# EAGLE design MIDILOOP.Schematic (EAGLE 7.5.0)
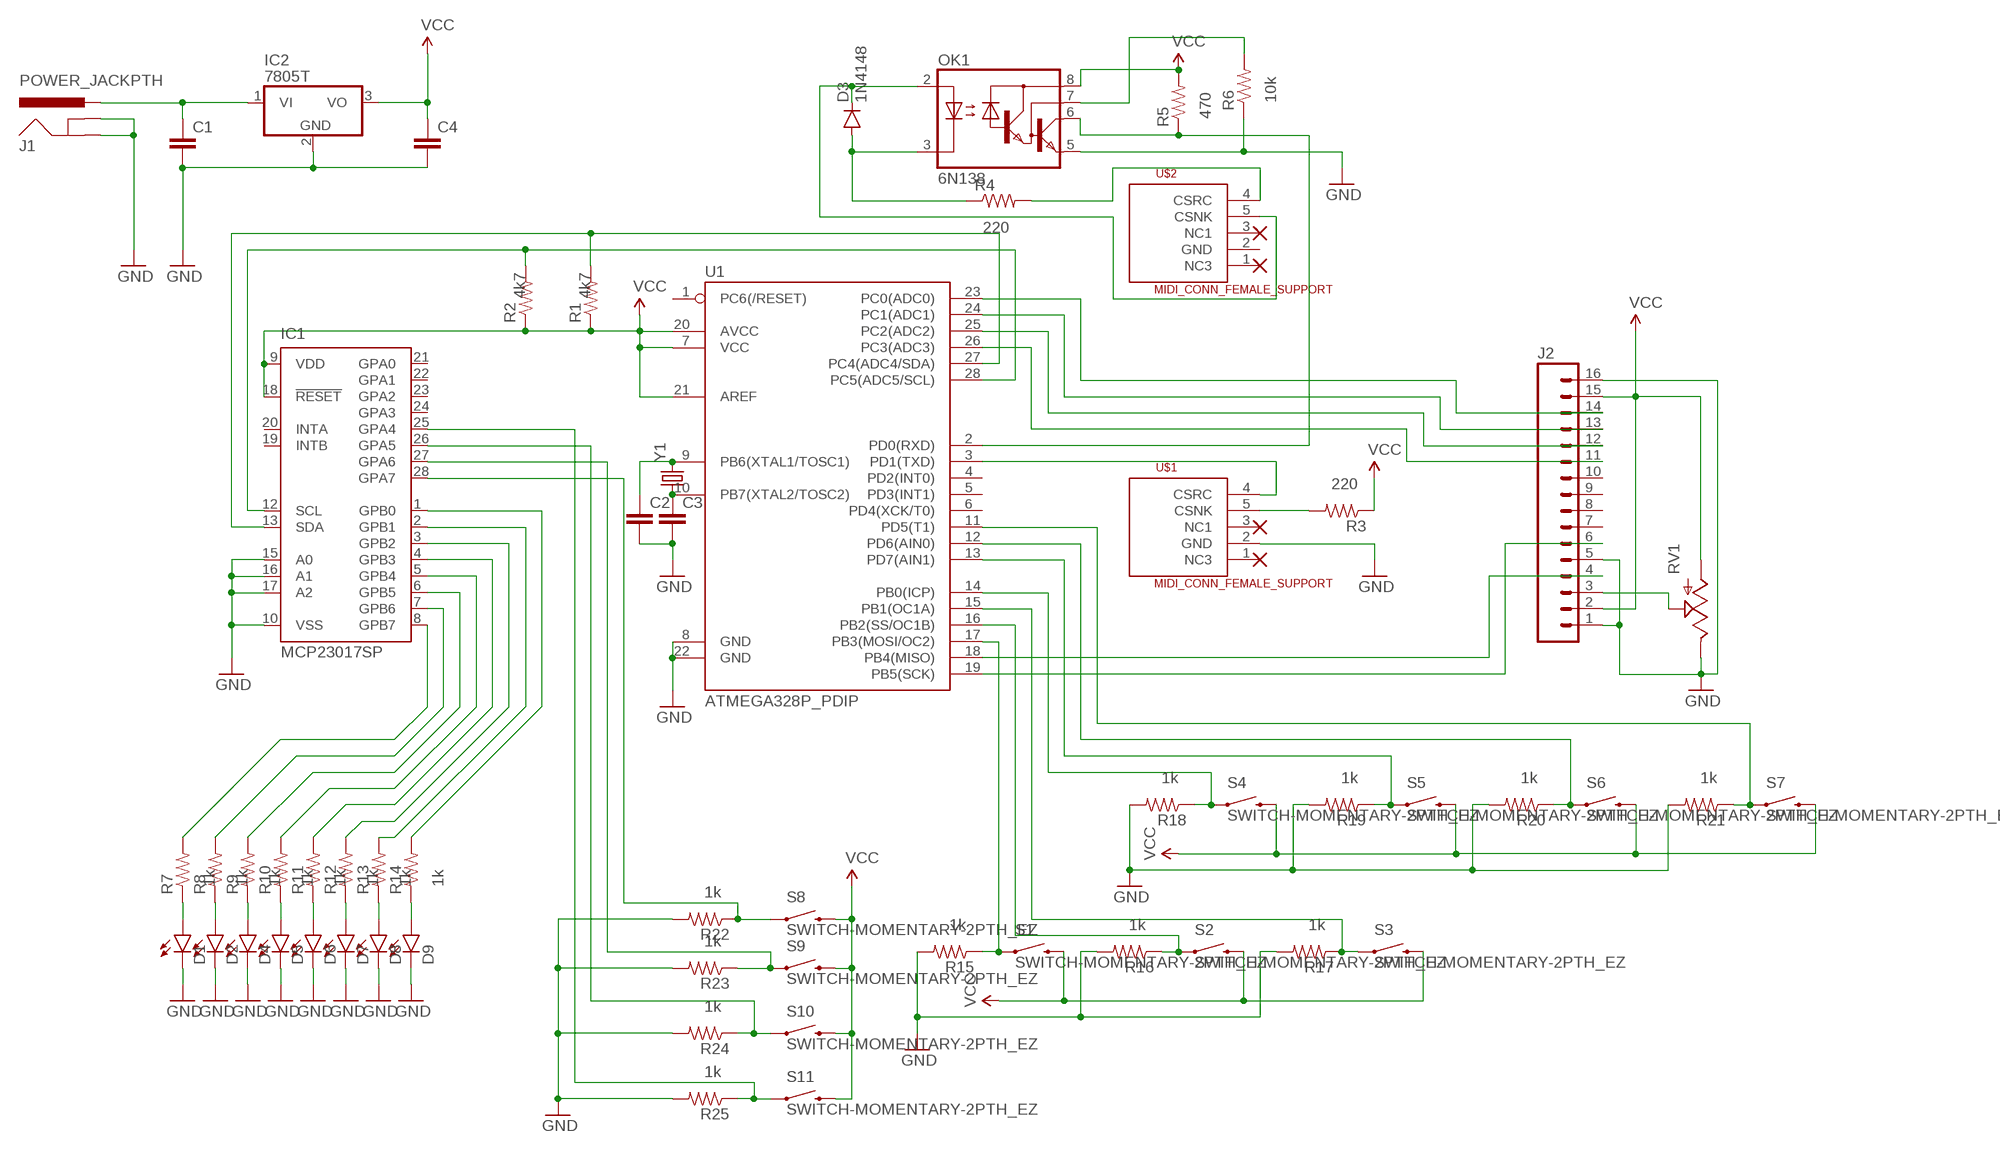
[diagram p0: schematic, sheet 1]

## Parts
C1  CAPPTH1  [CAP-PTH-5MM]
C2  CAPPTH  [CAP-PTH-SMALL]
C3  CAPPTH  [CAP-PTH-SMALL]
C4  CAPPTH1  [CAP-PTH-5MM]
D1  LED3MM  [LED3MM]
D2  LED3MM  [LED3MM]
D3  1N4148  DIODE1N4148  [DIODE-1N4148]
D4  LED3MM  [LED3MM]
D5  LED3MM  [LED3MM]
D6  LED3MM  [LED3MM]
D7  LED3MM  [LED3MM]
D8  LED3MM  [LED3MM]
D9  LED3MM  [LED3MM]
IC1  MCP23017SP  [DIL28-3]
IC2  7805T  [TO220H]
J1  POWER_JACKPTH  [POWER_JACK_PTH]
J2  M16LONGPADS  [1X16_LONGPADS]
OK1  6N138  [DIL08]
R1  RESISTOREZ  [AXIAL-0.3EZ]
R2  RESISTOREZ  [AXIAL-0.3EZ]
R3  RESISTOREZ  [AXIAL-0.3EZ]
R4  RESISTOREZ  [AXIAL-0.3EZ]
R5  RESISTOREZ  [AXIAL-0.3EZ]
R6  RESISTOREZ  [AXIAL-0.3EZ]
R7  RESISTOREZ  [AXIAL-0.3EZ]
R8  RESISTOREZ  [AXIAL-0.3EZ]
R9  RESISTOREZ  [AXIAL-0.3EZ]
R10  RESISTOREZ  [AXIAL-0.3EZ]
R11  RESISTOREZ  [AXIAL-0.3EZ]
R12  RESISTOREZ  [AXIAL-0.3EZ]
R13  RESISTOREZ  [AXIAL-0.3EZ]
R14  RESISTOREZ  [AXIAL-0.3EZ]
R15  RESISTOREZ  [AXIAL-0.3EZ]
R16  RESISTOREZ  [AXIAL-0.3EZ]
R17  RESISTOREZ  [AXIAL-0.3EZ]
R18  RESISTOREZ  [AXIAL-0.3EZ]
R19  RESISTOREZ  [AXIAL-0.3EZ]
R20  RESISTOREZ  [AXIAL-0.3EZ]
R21  RESISTOREZ  [AXIAL-0.3EZ]
R22  RESISTOREZ  [AXIAL-0.3EZ]
R23  RESISTOREZ  [AXIAL-0.3EZ]
R24  RESISTOREZ  [AXIAL-0.3EZ]
R25  RESISTOREZ  [AXIAL-0.3EZ]
RV1  POTTRIM  [TRIM_POT]
S1  SWITCH-MOMENTARY-2PTH_EZ  [TACTILE-PTH-EZ]
S2  SWITCH-MOMENTARY-2PTH_EZ  [TACTILE-PTH-EZ]
S3  SWITCH-MOMENTARY-2PTH_EZ  [TACTILE-PTH-EZ]
S4  SWITCH-MOMENTARY-2PTH_EZ  [TACTILE-PTH-EZ]
S5  SWITCH-MOMENTARY-2PTH_EZ  [TACTILE-PTH-EZ]
S6  SWITCH-MOMENTARY-2PTH_EZ  [TACTILE-PTH-EZ]
S7  SWITCH-MOMENTARY-2PTH_EZ  [TACTILE-PTH-EZ]
S8  SWITCH-MOMENTARY-2PTH_EZ  [TACTILE-PTH-EZ]
S9  SWITCH-MOMENTARY-2PTH_EZ  [TACTILE-PTH-EZ]
S10  SWITCH-MOMENTARY-2PTH_EZ  [TACTILE-PTH-EZ]
S11  SWITCH-MOMENTARY-2PTH_EZ  [TACTILE-PTH-EZ]
U1  ATMEGA328P_PDIP  [DIL28-3]
U$1  MIDI_CONN_FEMALE_SUPPORT  [DIN_5_FEMALE_SUPPORT]
U$2  MIDI_CONN_FEMALE_SUPPORT  [DIN_5_FEMALE_SUPPORT]
Y1  CRYSTALHC49US  [HC49US]

## Nets
GND: C1.2 C2.2 C3.2 C4.2 D1.K(C) D2.K(C) D4.K(C) D5.K(C) D6.K(C) D7.K(C) D8.K(C) D9.K(C) IC1.10(VSS) IC1.15(A0) IC1.16(A1) IC1.17(A2) IC2.2(GND) J1.GND J1.GNDBREAK J2.1 J2.5 J2.16 OK1.5(GND) R6.P$1 R15.P$2 R16.P$2 R17.P$2 R18.P$2 R19.P$2 R20.P$2 R21.P$2 R22.P$2 R23.P$2 R24.P$2 R25.P$2 RV1.2(E) U1.8(GND) U1.22(GND) U$1.2(GND)
N$1: C2.1 U1.9(PB6(XTAL1/TOSC1)) Y1.2
N$2: U1.3(PD1(TXD)) U$1.4(CSRC)
N$3: IC1.13(SDA) R1.P$2 U1.27(PC4(ADC4/SDA))
N$4: IC1.12(SCL) R2.P$2 U1.28(PC5(ADC5/SCL))
N$5: C3.1 U1.10(PB7(XTAL2/TOSC2)) Y1.1
N$6: R3.P$2 U$1.5(CSNK)
N$7: R4.P$2 U$2.4(CSRC)
N$8: D3.C OK1.2(A) U$2.5(CSNK)
N$9: D3.A OK1.3(C) R4.P$1
N$10: IC1.8(GPB7) R7.P$2
N$11: OK1.6(VO) R5.P$1 U1.2(PD0(RXD))
N$12: OK1.7(VB) R6.P$2
N$13: D1.A R7.P$1
N$14: IC1.7(GPB6) R8.P$2
N$15: D2.A R8.P$1
N$16: IC1.6(GPB5) R9.P$2
N$17: IC1.4(GPB3) R11.P$2
N$18: IC1.3(GPB2) R12.P$2
N$20: IC1.2(GPB1) R13.P$2
N$21: IC1.1(GPB0) R14.P$2
N$22: D4.A R9.P$1
N$23: D5.A R10.P$1
N$24: D6.A R11.P$1
N$25: D7.A R12.P$1
N$26: D8.A R13.P$1
N$27: D9.A R14.P$1
N$28: R15.P$1 S1.1 U1.17(PB3(MOSI/OC2))
N$29: R18.P$1 S4.1 U1.14(PB0(ICP))
N$30: R16.P$1 S2.1 U1.16(PB2(SS/OC1B))
N$31: R17.P$1 S3.1 U1.15(PB1(OC1A))
N$32: R19.P$1 S5.1 U1.13(PD7(AIN1))
N$33: J2.3 RV1.1(S)
N$34: R20.P$1 S6.1 U1.12(PD6(AIN0))
N$35: J2.4 U1.18(PB4(MISO))
N$36: J2.6 U1.19(PB5(SCK))
N$37: R21.P$1 S7.1 U1.11(PD5(T1))
N$38: J2.14 U1.23(PC0(ADC0))
N$39: J2.11 U1.26(PC3(ADC3))
N$40: J2.12 U1.25(PC2(ADC2))
N$41: J2.13 U1.24(PC1(ADC1))
N$42: IC1.27(GPA6) R23.P$1 S9.1
N$43: IC1.28(GPA7) R22.P$1 S8.1
N$44: IC1.26(GPA5) R24.P$1 S10.1
N$45: IC1.25(GPA4) R25.P$1 S11.1
N$46: C1.1 IC2.1(VI) J1.PWR
N$47: IC1.5(GPB4) R10.P$2
VCC: C4.1 IC1.9(VDD) IC1.18(!RESET) IC2.3(VO) J2.2 J2.15 OK1.8(VCC) R1.P$1 R2.P$1 R3.P$1 R5.P$2 RV1.3(A) S1.3 S2.3 S3.3 S4.3 S5.3 S6.3 S7.3 S8.3 S9.3 S10.3 S11.3 U1.7(VCC) U1.20(AVCC) U1.21(AREF)
Unconnected: IC1.19(INTB) IC1.20(INTA) IC1.21(GPA0) IC1.22(GPA1) IC1.23(GPA2) IC1.24(GPA3) J2.7 J2.8 J2.9 J2.10 U1.1(PC6(/RESET)) U1.4(PD2(INT0)) U1.5(PD3(INT1)) U1.6(PD4(XCK/T0)) U$1.1(NC3) U$1.3(NC1) U$2.1(NC3) U$2.2(GND) U$2.3(NC1)

## Library data of the parts
C1 C4 = SparkFun-Passives:CAP: Capacitor Standard 0603 ceramic capacitor, and 0.1" leaded capacitor.
C2 C3 = SparkFun-Capacitors:CAP: Capacitor Standard 0603 ceramic capacitor, and 0.1" leaded capacitor.
D1 D2 D4-D9 = SparkFun-LED:LED: LEDs Standard schematic elements and footprints for 5mm, 3mm, 1206, and 0603 sized LEDs. 5mm - Spark Fun Electronics SKU : COM-00529 (and others); PROD_ID: DIO-08794
D3 = SparkFun-DiscreteSemi:DIODE: Diode These are standard reverse protection diodes and small signal diodes. SMA package can handle up to about 1A. SOD-323 can handle about 200mA. What the SOD-323 package when ordering, there are some mfgs out there that are 5-pin packages.; PROD_ID: DIO-08378
IC1 = microchip:MCP23017: http://ww1.microchip.com/downloads/en/DeviceDoc/21952a.pdf Source: http://ww1.microchip.com/downloads/en/DeviceDoc/21952a.pdf; MF: MICROCHIP; MPN: MCP23017-E/SP; OC_FARNELL: 1332088; OC_NEWARK: 31K2959
IC2 = linear:78*: Positive VOLTAGE REGULATOR Source: http://cache.national.com/ds/LM/LM78L05.pdf http://www.fairchildsemi.com/ds/LM/LM7805.pdf
J1 = SparkFun-Connectors:POWER_JACK: Power Jack This is the standard 5.5mm barrel jack for power. The PTH is the most common, proven, reliable, footprint. The Slot footprint only works if the mill layer is transmitted to the PCB fab house so be warned. Mating wall wart : TOL-00298 (and others); PROD_ID: CONN-08197
J2 = SparkFun-Connectors:M16: 1x16 .1" header
OK1 = optocoupler:6N138: MOTOROLA OPTO COUPLER; MF: VISHAY/TELEFUNKEN; MPN: 6N138; OC_FARNELL: 9860150; OC_NEWARK: 35K5294
R1 R2 = SparkFun-Passives:RESISTOR: Resistor Basic schematic elements and footprints for 0603, 1206, and PTH resistors.; RESISTANCE: 4k7
R3 R4 = SparkFun-Passives:RESISTOR: Resistor Basic schematic elements and footprints for 0603, 1206, and PTH resistors.; RESISTANCE: 220
R5 = SparkFun-Passives:RESISTOR: Resistor Basic schematic elements and footprints for 0603, 1206, and PTH resistors.; RESISTANCE: 470
R6 = SparkFun-Passives:RESISTOR: Resistor Basic schematic elements and footprints for 0603, 1206, and PTH resistors.; RESISTANCE: 10k
R7-R25 = SparkFun-Passives:RESISTOR: Resistor Basic schematic elements and footprints for 0603, 1206, and PTH resistors.; RESISTANCE: 1k
RV1 = SparkFun-Electromechanical:POT
S1-S11 = SparkFun-Electromechanical:SWITCH-MOMENTARY-2: Various NO switches- pushbuttons, reed, etc
U1 = SparkFun-DigitalIC:ATMEGA328P_PDIP: uC used in the Arduino 32kb flash, 1k EEPROM, 2k SRAM This is the through-hole version of this chip.
U$1 U$2 = SparkFun-Connectors:MIDI_CONN_FEMALE_SUPPORT: MIDI connector with strain relief (DIN-5 female)
Y1 = SparkFun-FreqCtrl:CRYSTAL: Various standard crystals. Proven footprints.

## Board
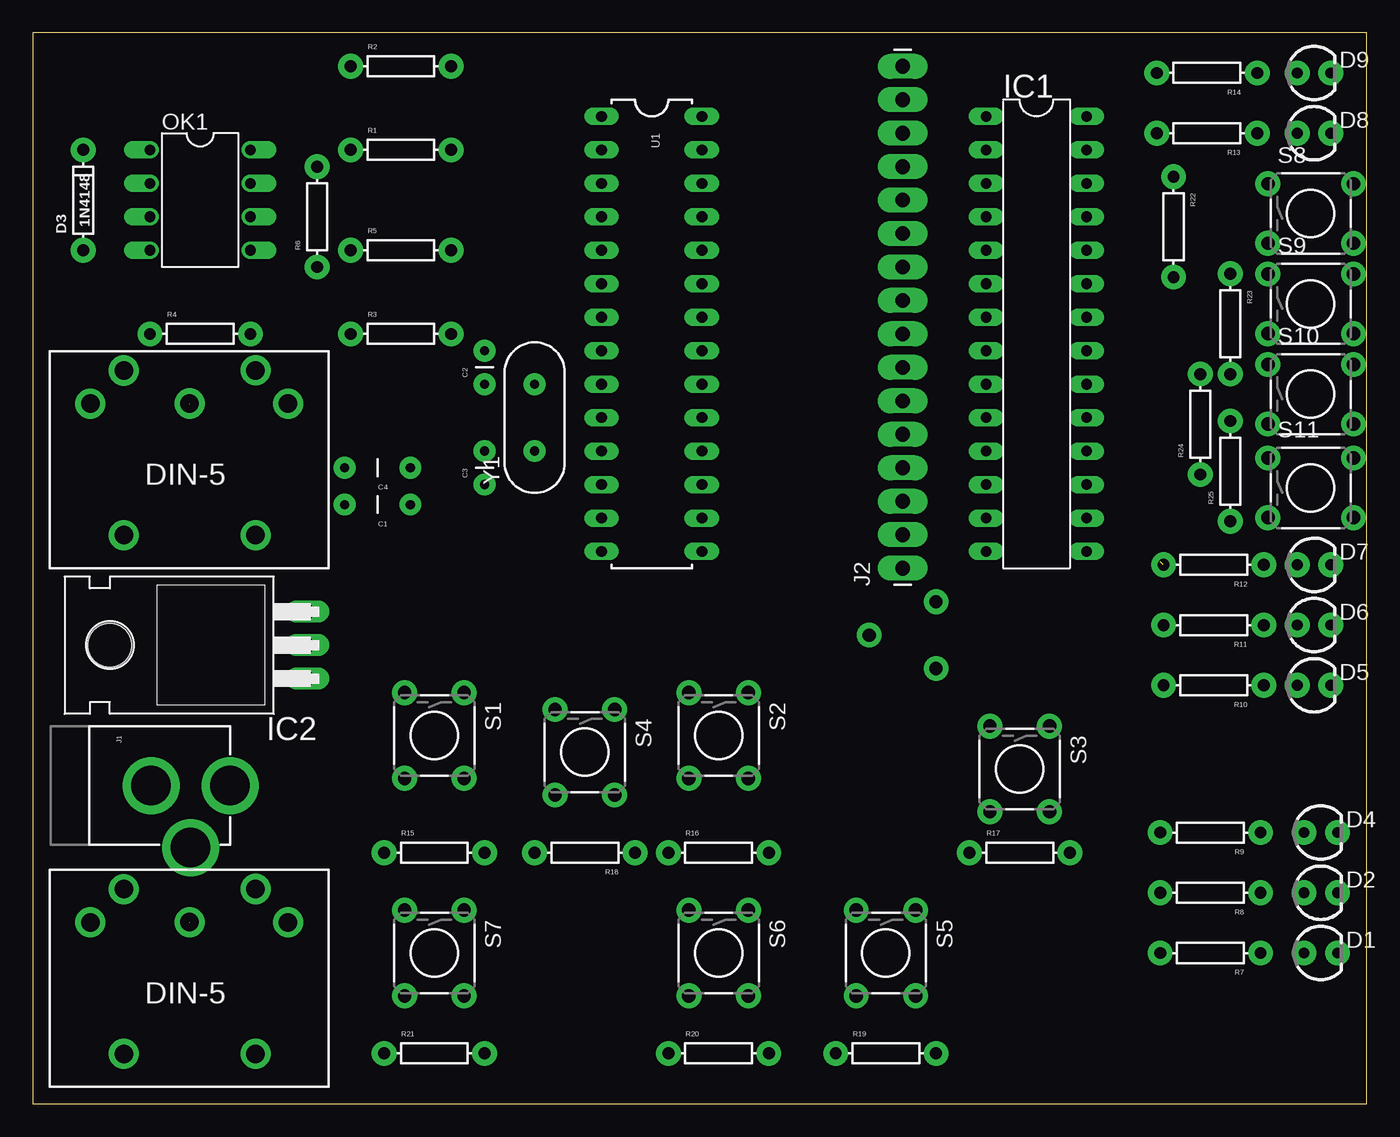
[diagram p1: board, top side]
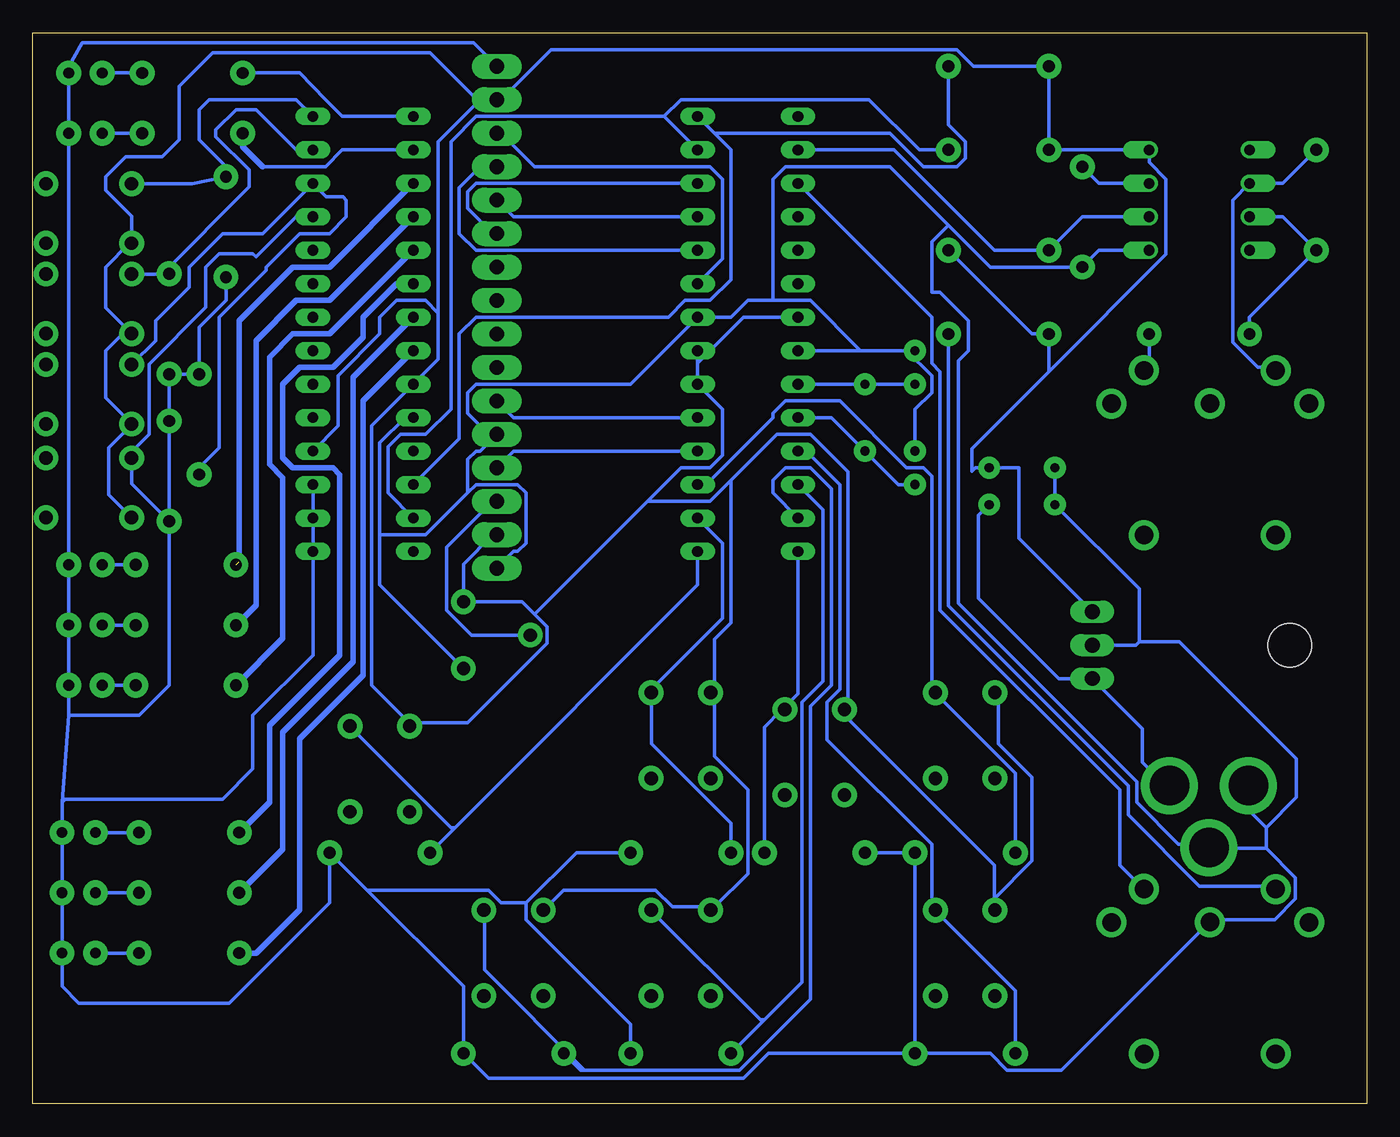
[diagram p2: board, bottom side, seen from below]

Size 101.27 x 81.27 mm. Coordinates in mm from the lower left corner, seen from the top.
Outline: 0,0 101.27,0 101.27,81.27 0,81.27 0,0
Copper layers (1*16): Top 0.035mm / dielectric 1.5mm / Bottom 0.035mm
Design rules "default": minimum track width 10mil, minimum drill 24mil, track to track 8mil, track to pad 8mil, pad to pad 8mil, via to via 8mil, smd to smd 8mil, copper to edge 40mil, drill to drill 8mil, minimum pad ring 10mil, minimum via ring 8mil, stop-mask expansion 4mil, vias tented up to drill 0mil, thermal gap 10mil

### Footprints (pad centres in the part's own frame; a part is rotated, then mirrored left to right if it is on the bottom)
CAP-PTH-5MM = drill 0.7 pad 1.651: 1 -2.5,0; 2 2.5,0
CAP-PTH-SMALL = drill 0.7 pad 1.651: 1 0,0; 2 2.54,0
LED3MM = drill 0.813 pad 1.88: A -1.27,0; K 1.27,0
DIODE-1N4148 = drill 0.9 pad 1.88: A -3.81,0; C 3.81,0
DIL28-3 = drill 0.813 long: 1 -16.51,-3.81; 2 -13.97,-3.81; 3 -11.43,-3.81; 4 -8.89,-3.81; 5 -6.35,-3.81; 6 -3.81,-3.81; 7 -1.27,-3.81; 8 1.27,-3.81; 9 3.81,-3.81; 10 6.35,-3.81; 11 8.89,-3.81; 12 11.43,-3.81; 13 13.97,-3.81; 14 16.51,-3.81; 15 16.51,3.81; 16 13.97,3.81; 17 11.43,3.81; 18 8.89,3.81; 19 6.35,3.81; 20 3.81,3.81; 21 1.27,3.81; 22 -1.27,3.81; 23 -3.81,3.81; 24 -6.35,3.81; 25 -8.89,3.81; 26 -11.43,3.81; 27 -13.97,3.81; 28 -16.51,3.81
TO220H = drill 1.118 long: 1 -2.54,-10.16; 2 0,-10.16; 3 2.54,-10.16 | hole 3.302: 0,4.826
POWER_JACK_PTH = drill 2.997 pad 4.318: GND 0,7.7; GNDBREAK 4.7,10.7; PWR 0,13.7
1X16_LONGPADS = drill 1.118 pad 1.88 long: 1 0,0; 2 2.54,0; 3 5.08,0; 4 7.62,0; 5 10.16,0; 6 12.7,0; 7 15.24,0; 8 17.78,0; 9 20.32,0; 10 22.86,0; 11 25.4,0; 12 27.94,0; 13 30.48,0; 14 33.02,0; 15 35.56,0; 16 38.1,0
DIL08 = drill 0.813 offset: 1 -3.81,-3.81; 2 -1.27,-3.81; 3 1.27,-3.81; 4 3.81,-3.81; 5 3.81,3.81; 6 1.27,3.81; 7 -1.27,3.81; 8 -3.81,3.81
AXIAL-0.3EZ = drill 0.9 pad 1.88: P$1 -3.81,0; P$2 3.81,0
TRIM_POT = drill 1 pad 1.88: 1 5.08,0; 2 0,2.54; 3 0,-2.54
TACTILE-PTH-EZ = drill 1.016 pad 1.88: 1 -3.251,2.261; 2 3.251,2.261; 3 -3.251,-2.261; 4 3.251,-2.261
DIN_5_FEMALE_SUPPORT = drill 1.4 pad 2.286: 1 7.94,3.6; 2 0.46,3.61; 3 -7.07,3.6; 4 5.47,6.13; 5 -4.53,6.12; 6 -4.53,-6.382; 7 5.478,-6.382
HC49US = drill 0.7 pad 1.651: 1 -2.54,0; 2 2.54,0

### Placement (x,y rotation side)
C1  26.16,45.47 180 top
C2  34.29,54.61 90 top
C3  34.29,46.99 90 top
C4  26.16,48.26 180 top
D1  97.79,11.43 0 top
D2  97.79,16 0 top
D3  3.81,68.58 90 top
D4  97.79,20.57 0 top
D5  97.28,31.75 0 top
D6  97.28,36.32 0 top
D7  97.28,40.89 0 top
D8  97.28,73.66 0 top
D9  97.28,78.23 0 top
IC1  76.2,58.42 270 top
IC2  10.67,34.8 90 top
J1  1.27,24.13 270 top
J2  66.04,40.64 90 top
OK1  12.7,68.58 270 top
R1  27.94,72.39 0 top
R2  27.94,78.74 0 top
R3  27.94,58.42 0 top
R4  12.7,58.42 0 top
R5  27.94,64.77 0 top
R6  21.59,67.31 90 top
R7  89.41,11.43 180 top
R8  89.41,16 180 top
R9  89.41,20.57 180 top
R10  89.66,31.75 180 top
R11  89.66,36.32 180 top
R12  89.66,40.89 180 top
R13  89.15,73.66 180 top
R14  89.15,78.23 180 top
R15  30.48,19.05 0 top
R16  52.07,19.05 0 top
R17  74.93,19.05 0 top
R18  41.91,19.05 180 top
R19  64.77,3.81 0 top
R20  52.07,3.81 0 top
R21  30.48,3.81 0 top
R22  86.61,66.55 270 top
R23  90.93,59.18 270 top
R24  88.65,51.56 90 top
R25  90.93,48.01 90 top
RV1  68.58,35.56 180 top
S1  30.48,27.94 270 top
S2  52.07,27.94 270 top
S3  74.93,25.4 270 top
S4  41.91,26.67 270 top
S5  64.77,11.43 270 top
S6  52.07,11.43 270 top
S7  30.48,11.43 270 top
S8  97.03,67.56 0 top
S9  97.03,60.71 0 top
S10  97.03,53.85 0 top
S11  97.03,46.74 0 top
U1  46.99,58.42 270 top
U$1  11.43,10.16 0 top
U$2  11.43,49.53 0 top
Y1  38.1,52.07 90 top

### Tracks (layer width: path | path; a pad name or v marks a point on that pad's centre or on a via)
GND
  Bottom 0.254: IC1.10 73.03,52.07 74.93,50.16 74.93,43.18 | 74.93,43.18 74.93,39.37 RV1.2 | J2.1 64.77,41.91 64.45,41.91 63.82,42.55 63.82,46.35 64.45,46.99 67.63,46.99 68.26,46.35 | 68.26,46.35 71.44,43.18 74.93,43.18 | 66.36,50.48 67.31,49.53 67.63,49.53 68.26,48.9 68.26,46.35 | OK1.5 20.32,64.77 R6.P$1 28.57,63.5 31.75,66.67 | 34.92,57.15 38.42,57.15 | 38.42,57.15 U1.8 | 45.09,60.96 42.23,60.96 38.42,57.15 | 45.09,60.96 46.99,60.96 48.26,59.69 U1.22 55.88,54.61 67.63,54.61 68.26,53.98 68.26,52.39 66.36,50.48 | C3.2 34.29,52.7 33.02,53.98 33.02,55.24 34.92,57.15 | 34.92,57.15 C2.2 | 31.75,66.67 36.2,71.12 44.13,71.12 45.09,70.17 45.09,60.96 | 66.36,50.48 J2.5 | R21.P$2 R15.P$2 R18.P$2 | 7.62,19.37 5.4,17.14 5.4,15.56 6.99,13.97 11.75,13.97 U$1.2 12.06,13.65 23.18,2.54 27.3,2.54 28.57,3.81 R21.P$2 | 7.62,19.37 11.75,19.37 J1.GNDBREAK 12.06,19.68 14.29,19.68 17.46,22.86 17.46,24.45 30.99,37.97 30.99,56.39 30.23,57.15 30.23,59.44 32.38,61.59 33.02,61.59 33.02,65.41 31.75,66.67 | 7.62,20.95 7.62,19.37 | R20.P$2 55.88,6.03 63.82,13.97 63.82,15.24 | 63.82,15.24 60.01,19.05 R16.P$2 | 75.88,16.19 R17.P$2 78.74,15.24 86.36,7.62 97.79,7.62 99.06,8.89 D1.K D2.K D4.K 99.06,22.86 | 75.88,16.19 68.58,8.89 R19.P$2 66.67,1.91 47.31,1.91 45.4,3.81 R21.P$2 | 63.82,15.24 65.72,15.24 66.67,16.19 75.88,16.19 | IC1.17 IC1.16 IC1.15 80.01,34.04 84.58,29.46 84.58,25.4 86.87,23.11 98.81,23.11 99.06,22.86 | 98.55,29.46 D5.K D6.K D7.K D8.K D9.K 98.81,78.23 97.54,80.52 67.82,80.52 J2.16 | 98.55,29.46 99.06,22.86 | C4.2 C1.2 17.27,39.08 17.27,35.05 | 17.27,35.05 17.53,34.8 IC2.2 | 7.62,20.95 8.97,22.3 J1.GND
  Bottom 0.254: 7.62,20.95 5.33,23.24 5.33,26.16 14.22,35.05 17.27,35.05 | 98.55,29.46 93.22,29.46 90.93,31.75 R25.P$2 R23.P$2 R24.P$2 88.65,58.93 86.61,60.96 R22.P$2
N$1
  Bottom 0.254: U1.9 Y1.2 C2.1
N$2
  Bottom 0.254: U1.3 33.02,59.69 33.02,56.2 32.38,55.56 32.38,37.47 18.73,23.81 18.73,18.1 17.14,16.51 U$1.4
N$3
  Bottom 0.254: IC1.13 74.3,46.35 74.3,49.85 73.34,50.8 71.44,50.8 69.53,52.7 69.53,73.03 67.63,74.93 53.34,74.93 | U1.27 53.34,74.93 | R1.P$2 33.97,72.39 37.78,76.2 52.07,76.2 53.34,74.93
N$4
  Bottom 0.254: IC1.12 68.9,50.48 68.9,58.42 67.63,59.69 53.02,59.69 51.75,60.96 49.85,60.96 48.26,62.55 48.26,72.39 49.53,73.66 | U1.28 49.53,73.66 | R2.P$2 31.75,74.3 30.48,73.03 30.48,71.75 31.11,71.12 33.66,71.12 36.2,73.66 49.53,73.66
N$5
  Bottom 0.254: U1.10 40.64,52.07 Y1.1 35.56,46.99 C3.1
N$6
  Bottom 0.254: R3.P$2 31.75,37.78 18.1,24.13 18.1,21.91 12.7,16.51 6.99,16.51 U$1.5
N$7
  Bottom 0.254: R4.P$2 16.51,56.2 16.83,55.88 U$2.4
N$8
  Bottom 0.254: D3.C 6.35,69.85 OK1.2 10.16,68.58 10.16,57.78 8.26,55.88 6.99,55.88 U$2.5
N$9
  Bottom 0.254: OK1.3 6.35,67.31 D3.A 8.89,59.69 R4.P$1
N$10
  Bottom 0.406: R7.P$2 84.33,11.43 81.03,14.73 81.03,27.69 76.2,32.51 76.2,53.34 IC1.8
N$11
  Bottom 0.254: OK1.6 21.59,67.31 R5.P$1 28.26,64.77 35.88,72.39 U1.2
N$12
  Bottom 0.254: OK1.7 20.32,69.85 R6.P$2
N$13
  Bottom 0.254: D1.A R7.P$1
N$14
  Bottom 0.406: R8.P$2 82.3,19.3 82.3,28.19 76.96,33.53 76.96,55.12 IC1.7
N$15
  Bottom 0.254: D2.A R8.P$1
N$16
  Bottom 0.406: IC1.6 73.66,62.23 76.2,59.69 76.2,58.17 78.49,55.88 81.03,55.88 82.3,54.61 82.3,49.02 81.53,48.26 78.49,48.26 77.98,47.75 77.98,34.04 83.31,28.7 83.31,22.86 R9.P$2
N$17
  Bottom 0.406: IC1.4 78.74,60.96 81.28,60.96 84.33,57.91 84.33,37.85 R11.P$2
N$18  (1 unrouted)
  Bottom 0.406: IC1.3 78.74,63.5 81.53,63.5 85.6,59.44 85.6,41.15
N$20
  Bottom 0.254: IC1.2 77.79,72.39 79.06,71.12 83.82,71.12
  Bottom 0.406: R13.P$2 85.34,72.64 83.82,71.12
N$21
  Bottom 0.254: IC1.1 77.79,74.93 79.06,76.2 81.03,78.23 R14.P$2
N$22
  Bottom 0.254: D4.A R9.P$1
N$23
  Bottom 0.254: D5.A R10.P$1
N$24
  Bottom 0.254: D6.A R11.P$1
N$25
  Bottom 0.254: D7.A R12.P$1
N$26
  Bottom 0.254: D8.A R13.P$1
N$27
  Bottom 0.254: D9.A R14.P$1
N$28
  Bottom 0.254: U1.17 50.16,46.99 45.09,52.07 45.09,52.39 44.13,53.34 40.01,53.34 34.92,48.26 33.66,48.26 33.02,47.62 33.02,31.43 S1.1 32.7,31.11 26.67,25.08 R15.P$1
N$29
  Bottom 0.254: U1.14 43.18,31.11 44.13,30.16 S4.1 44.45,29.84 45.72,28.57 R18.P$1
N$30
  Bottom 0.254: U1.16 48.9,42.55 48.9,36.83 54.29,31.43 S2.1 54.29,31.11 54.29,27.3 48.26,21.27 R16.P$1
N$31
  Bottom 0.254: U1.15 50.8,39.37 69.22,20.95 | R17.P$1 69.22,20.95 | 69.22,20.95 69.53,20.95 77.15,28.57 S3.1
N$32
  Bottom 0.254: U1.13 45.09,46.35 45.09,47.31 44.13,48.26 42.23,48.26 40.64,46.67 40.64,31.75 42.23,30.16 42.23,7.94 47.62,2.54 59.37,2.54 | 59.37,2.54 59.69,2.54 R19.P$1 | 59.37,2.54 66.99,10.16 66.99,14.61 S5.1
N$33
  Bottom 0.254: RV1.1 67.94,35.56 69.85,37.47 69.85,42.23 66.36,45.72 J2.3
N$34
  Bottom 0.254: U1.12 41.27,45.09 41.27,32.07 42.86,30.48 42.86,9.21 45.72,6.35 | R20.P$1 45.72,6.35 | 45.72,6.35 46.04,6.35 54.29,14.61 S6.1
N$35
  Bottom 0.254: U1.18 64.77,49.53 J2.4
N$36
  Bottom 0.254: U1.19 64.77,52.07 J2.6
N$37
  Bottom 0.254: U1.11 42.55,49.53 40.01,46.99 40.01,31.43 40.96,30.48 40.96,27.62 33.02,19.68 33.02,14.92 S7.1 32.7,14.61 26.67,8.57 R21.P$1
N$38
  Bottom 0.254: U1.23 48.9,64.14 48.9,70.17 49.85,71.12 63.18,71.12 65.72,73.66 J2.14
N$39
  Bottom 0.254: U1.26 67.63,69.85 68.26,69.22 68.26,67.94 66.36,66.04 J2.11
N$40
  Bottom 0.254: U1.25 64.77,67.31 J2.12
N$41
  Bottom 0.254: U1.24 67.63,64.77 68.9,66.04 68.9,69.53 67.31,71.12 J2.13
N$42
  Bottom 0.254: R23.P$1 90.96,62.97 S9.1 91.47,62.97 84.84,69.6 84.84,70.87 87.38,73.41 87.38,73.91 85.85,75.44 84.33,75.44 81.28,72.39 IC1.27
N$43
  Bottom 0.254: S8.1 89.18,69.83 R22.P$1 86.61,71.12 88.65,73.15 88.65,75.44 87.88,76.2 81.28,76.2 IC1.28
N$44
  Bottom 0.254: S10.1 93.75,56.11 91.95,57.91 91.95,59.44 89.41,61.98 89.41,63.5 86.87,66.04 83.82,66.04 IC1.26 78.99,68.83 77.72,68.83 77.47,68.58 77.47,67.31 78.74,66.04 81.03,66.04 83.57,63.5 83.57,63.25 87.12,59.69 87.12,49.78 88.65,48.26 R24.P$1
N$45
  Bottom 0.254: R25.P$1 93.78,47.04 S11.1 93.78,49.48 92.46,50.8 92.46,56.13 88.14,60.45 88.14,63.5 87.12,64.52 84.58,64.52 84.33,64.26 81.28,67.31 IC1.25
N$46
  Bottom 0.254: C1.1 29.46,44.66 29.46,38.35 23.37,32.26 IC2.1 17.02,28.45 17.02,25.91 15.24,24.13 J1.PWR
N$47
  Bottom 0.406: IC1.5 78.74,58.42 81.53,58.42 83.31,56.64 83.31,48.51 82.3,47.5 82.3,35.31 R10.P$2
VCC
  Bottom 0.254: R5.P$2 25.4,58.42 R3.P$1 24.13,55.56 | 24.13,55.56 15.24,64.45 15.24,70.17 16.51,71.44 OK1.8 R1.P$1 R2.P$1 29.84,78.74 31.11,80.01 61.91,80.01 65.72,76.2 J2.15 67.31,76.2 67.44,76.07 | S5.3 62.23,14.92 60.96,16.19 53.98,16.19 52.7,14.92 49.85,14.92 S6.3 49.53,14.92 46.99,17.46 46.99,23.81 49.53,26.35 49.53,31.11 S2.3 49.53,31.43 49.53,35.24 48.26,36.51 48.26,47.31 | 28.26,15.56 28.26,18.1 39.37,29.21 39.37,29.84 S4.3 39.37,30.16 39.37,47.94 42.23,50.8 44.77,50.8 48.26,47.31 | 28.26,15.56 28.26,14.92 S7.3 28.26,15.56 | 28.26,15.56 25.4,18.41 25.4,24.77 27.94,27.3 27.94,31.11 S1.3 | U1.21 50.8,56.2 | 50.8,56.2 U1.20 48.9,52.7 48.9,49.21 49.85,48.26 52.07,48.26 54.61,45.72 | U1.7 47.31,59.69 50.8,56.2 | J2.2 66.36,43.18 68.58,40.96 RV1.3 64.14,38.1 63.18,37.15 | IC1.18 78.11,51.44 78.11,55.24 74.93,58.42 74.93,59.69 73.66,60.96 71.44,60.96 70.48,60.01 | 70.48,60.01 70.48,56.52 IC1.9 75.56,51.44 75.56,31.75 72.71,28.89 S3.3 72.39,28.89 68.26,28.89 62.23,34.92 62.23,36.2 63.18,37.15 | 67.44,76.07 70.48,73.03 70.48,60.01 | 63.18,37.15 54.61,45.72 | 48.26,47.31 49.85,45.72 54.61,45.72 | 24.13,55.56 29.97,49.72 29.97,48.01 29.72,48.26 C4.1 26.42,48.26 26.42,42.93 IC2.3 | S11.3 95.5,46.2 95.5,49.78 93.78,51.51 S10.3 95.76,53.57 95.76,57.15 94.46,58.45 S9.3 95.76,60.43 95.76,63.5 93.95,65.3 S8.3 93.78,67.36 95.76,69.34 95.76,70.36 94.23,71.88 91.44,71.88 90.17,73.15 90.17,77.22 87.63,79.76 71.12,79.76 67.44,76.07